# EAGLE schematic temp_sensors_array (EAGLE 7.5.0)
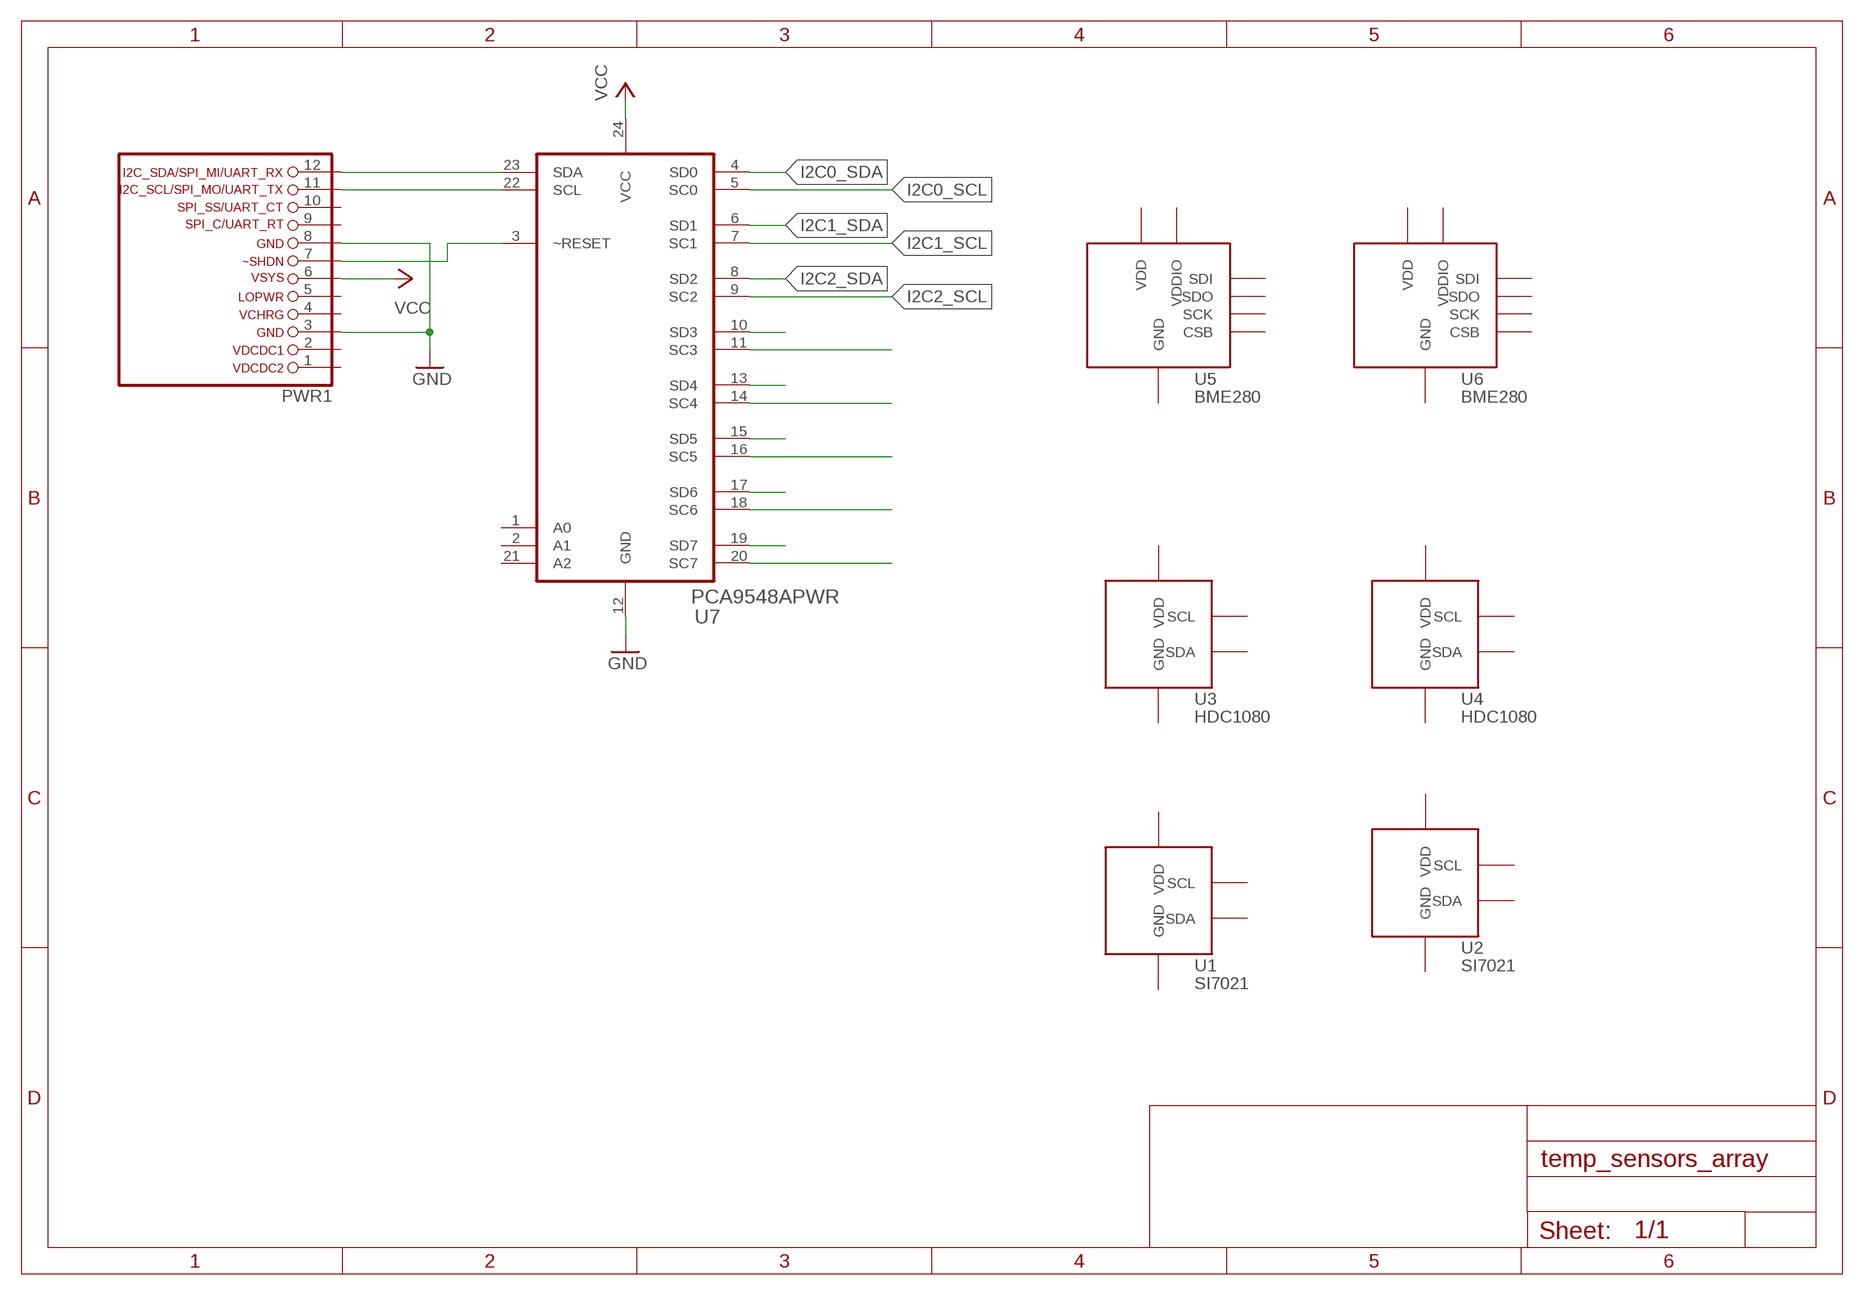
[diagram p0: schematic, sheet 1]

## Parts
PWR1  LIWE_12_PIN_PWR  [LIWE_12_PIN]
U1  SI7021  [SI7021]
U2  SI7021  [SI7021]
U3  HDC1080  [SI7021]
U4  HDC1080  [SI7021]
U5  BME280  [BME1080]
U6  BME280  [BME1080]
U7  PCA9548APWR  [SOP65P640X120-24N]

## Nets
GND: PWR1.3 PWR1.8 U7.12(GND)
I2C0_SCL: U7.5(SC0)
I2C0_SDA: U7.4(SD0)
I2C1_SCL: U7.7(SC1)
I2C1_SDA: U7.6(SD1)
I2C2_SCL: U7.9(SC2)
I2C2_SDA: U7.8(SD2)
N$1: PWR1.12 U7.23(SDA)
N$2: PWR1.11 U7.22(SCL)
N$3: PWR1.7 U7.3(~RESET)
N$4: U7.10(SD3)
N$5: U7.11(SC3)
N$6: U7.13(SD4)
N$7: U7.14(SC4)
N$8: U7.15(SD5)
N$9: U7.16(SC5)
N$10: U7.17(SD6)
N$11: U7.18(SC6)
N$12: U7.19(SD7)
N$13: U7.20(SC7)
VCC: PWR1.6 U7.24(VCC)
Unconnected: PWR1.1 PWR1.2 PWR1.4 PWR1.5 PWR1.9 PWR1.10 U1.1(SDA) U1.6(SCL) U2.1(SDA) U2.6(SCL) U3.1(SDA) U3.6(SCL) U4.1(SDA) U4.6(SCL) U5.2(CSB) U5.3(SDI) U5.4(SCK) U5.5(SDO) U6.2(CSB) U6.3(SDI) U6.4(SCK) U6.5(SDO) U7.1(A0) U7.2(A1) U7.21(A2)

## Power pins joined to a net without a drawn wire
GND: U1.2(GND) U2.2(GND) U3.2(GND) U4.2(GND) U5.1(GND) U5.7(GND) U6.1(GND) U6.7(GND)
VDD: U1.5(VDD) U2.5(VDD) U3.5(VDD) U4.5(VDD) U5.8(VDD) U6.8(VDD)
VDDIO: U5.6(VDDIO) U6.6(VDDIO)

## Library data of the parts
PWR1 = 25cmsquare:LIWE_12_PIN_PWR
U1 U2 = 25cmsquare:SI7021: SI7021 https://www.silabs.com/Support%20Documents/TechnicalDocs/Si7021-A20.pdf
U3 U4 = 25cmsquare:HDC1080: HDC1080 http://www.ti.com.cn/cn/lit/ds/symlink/hdc1080.pdf
U5 U6 = 25cmsquare:BME280
U7 = Texas Instruments_By_element14_Batch_1:PCA9548APWR: 8-CHANNEL I2C SWITCH WITH RESET; MPN: PCA9548APWR False; OC_FARNELL: 1607855; OC_NEWARK: 22M1602; PACKAGE: TSSOP-24; SUPPLIER: Texas Instruments